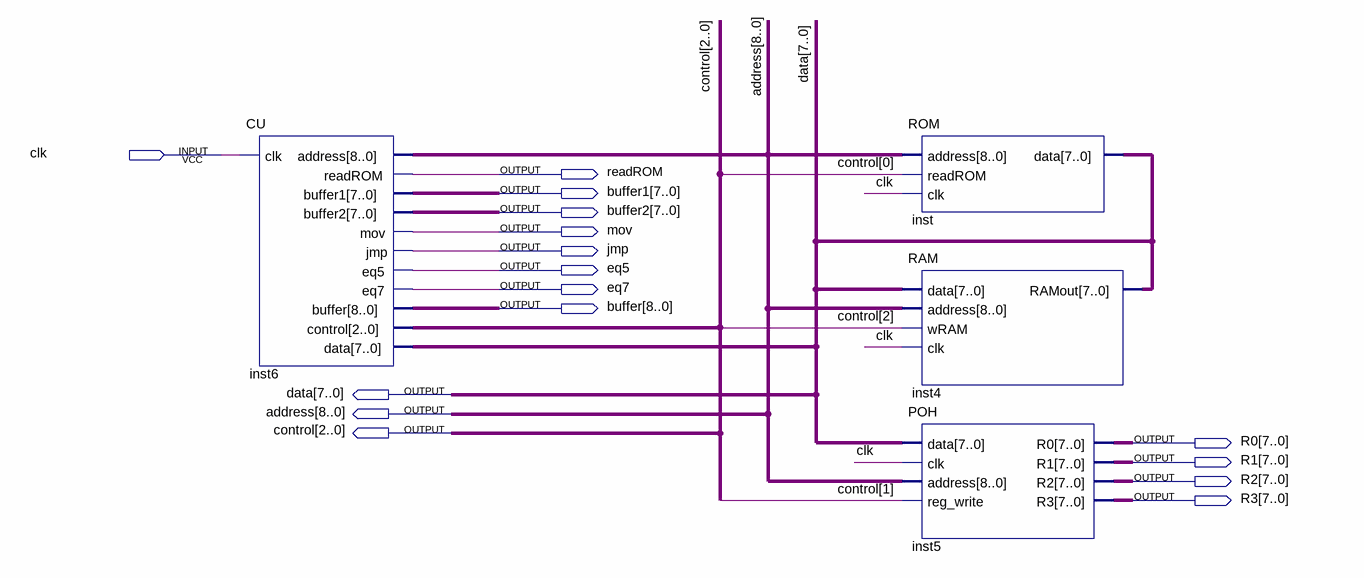
[diagram p0: schematic sheet]
// Quartus schematic main.bdf as structural Verilog: 4 symbols, 16 pins
module main (
  input  clk,
  output readROM,
  output [7:0] buffer1,
  output [7:0] buffer2,
  output mov,
  output jmp,
  output eq5,
  output eq7,
  output [8:0] buffer,
  output [7:0] data,
  output [8:0] address,
  output [2:0] control,
  output [7:0] R0,
  output [7:0] R1,
  output [7:0] R2,
  output [7:0] R3
);

  CU inst6 (
    .clk(clk), .address(address), .readROM(readROM), .buffer1(buffer1), .buffer2(buffer2), .mov(mov),
    .jmp(jmp), .eq5(eq5), .eq7(eq7), .buffer(buffer), .control(control), .data(data));
  ROM inst (.address(address), .readROM(control[0]), .clk(clk), .data(data));
  RAM inst4 (.data(data), .address(address), .wRAM(control[2]), .clk(clk), .RAMout(data));
  POH inst5 (.data(data), .clk(clk), .address(address), .reg_write(control[1]), .R0(R0), .R1(R1), .R2(R2), .R3(R3));
endmodule
